# Altium project PCB_Project.PrjPcb
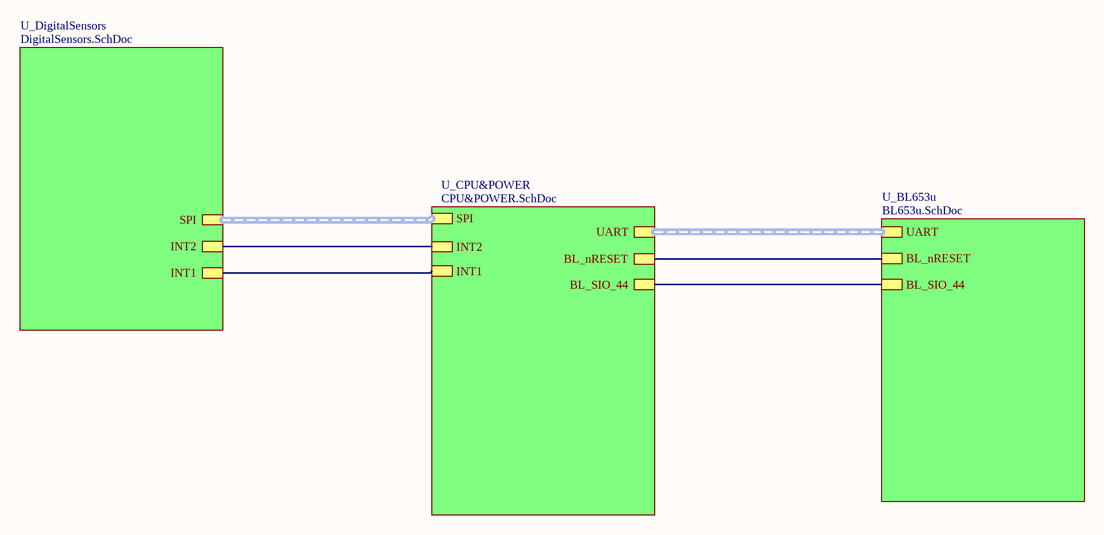
[diagram p0: Main.SchDoc]
2 sheets, 18 parts. Net scope: hierarchical (ports join the sheet entries above them; power ports are global).
Board file: PCB_Heartband.PcbDoc
Sheets:
  Main.SchDoc
    U_CPU&POWER = CPU&POWER.SchDoc

## Sheet Main.SchDoc: Sweet Dreams - Main
size 292 x 193 mm; Author: Mikołaj Roszczyk; CompanyName: Politechnika Warszawska; Organization: WEITI; Revision: 2; SheetNumber: 1; SheetTotal: 4; Group_Name: Under Pressure; ProjName: Sweet Dreams

### Sub-sheets
U_BL653u = BL653u.SchDoc (file not in this document): UART (harness BL_UART31), BL_nRESET, BL_SIO_44
U_CPU&POWER = CPU&POWER.SchDoc: SPI (harness SPI1), INT2, INT1, UART (harness BL_UART31), BL_SIO_44, BL_nRESET
U_DigitalSensors = DigitalSensors.SchDoc (file not in this document): SPI (harness SPI1), INT1, INT2

### Nets
NetIC1_18: sheet U_DigitalSensors/INT1, sheet U_CPU&POWER/INT1
NetIC1_25: sheet U_BL653u/BL_nRESET, sheet U_CPU&POWER/BL_nRESET
NetIC1_26: sheet U_BL653u/BL_SIO_44, sheet U_CPU&POWER/BL_SIO_44
NetIC1_27: sheet U_DigitalSensors/INT2, sheet U_CPU&POWER/INT2

### Buses and harness runs
harness sheet U_BL653u/UART = sheet U_CPU&POWER/UART
harness sheet U_CPU&POWER/SPI = sheet U_DigitalSensors/SPI

### Notes on the sheet
- Data:
- Tytuł:
- Rev.:
- Rozm.:
- A4
- Strona:
- z
- PBL4
- Opracował:

## Sheet CPU&POWER.SchDoc: MCU&Power
size 292 x 193 mm; Author: Michał Borkowski; CompanyName: Politechnika Warszawska; Organization: WEITI; Revision: 3; SheetNumber: 4; SheetTotal: 4; ProjName: Sweet Dreams; Group_Name: Under Pressure
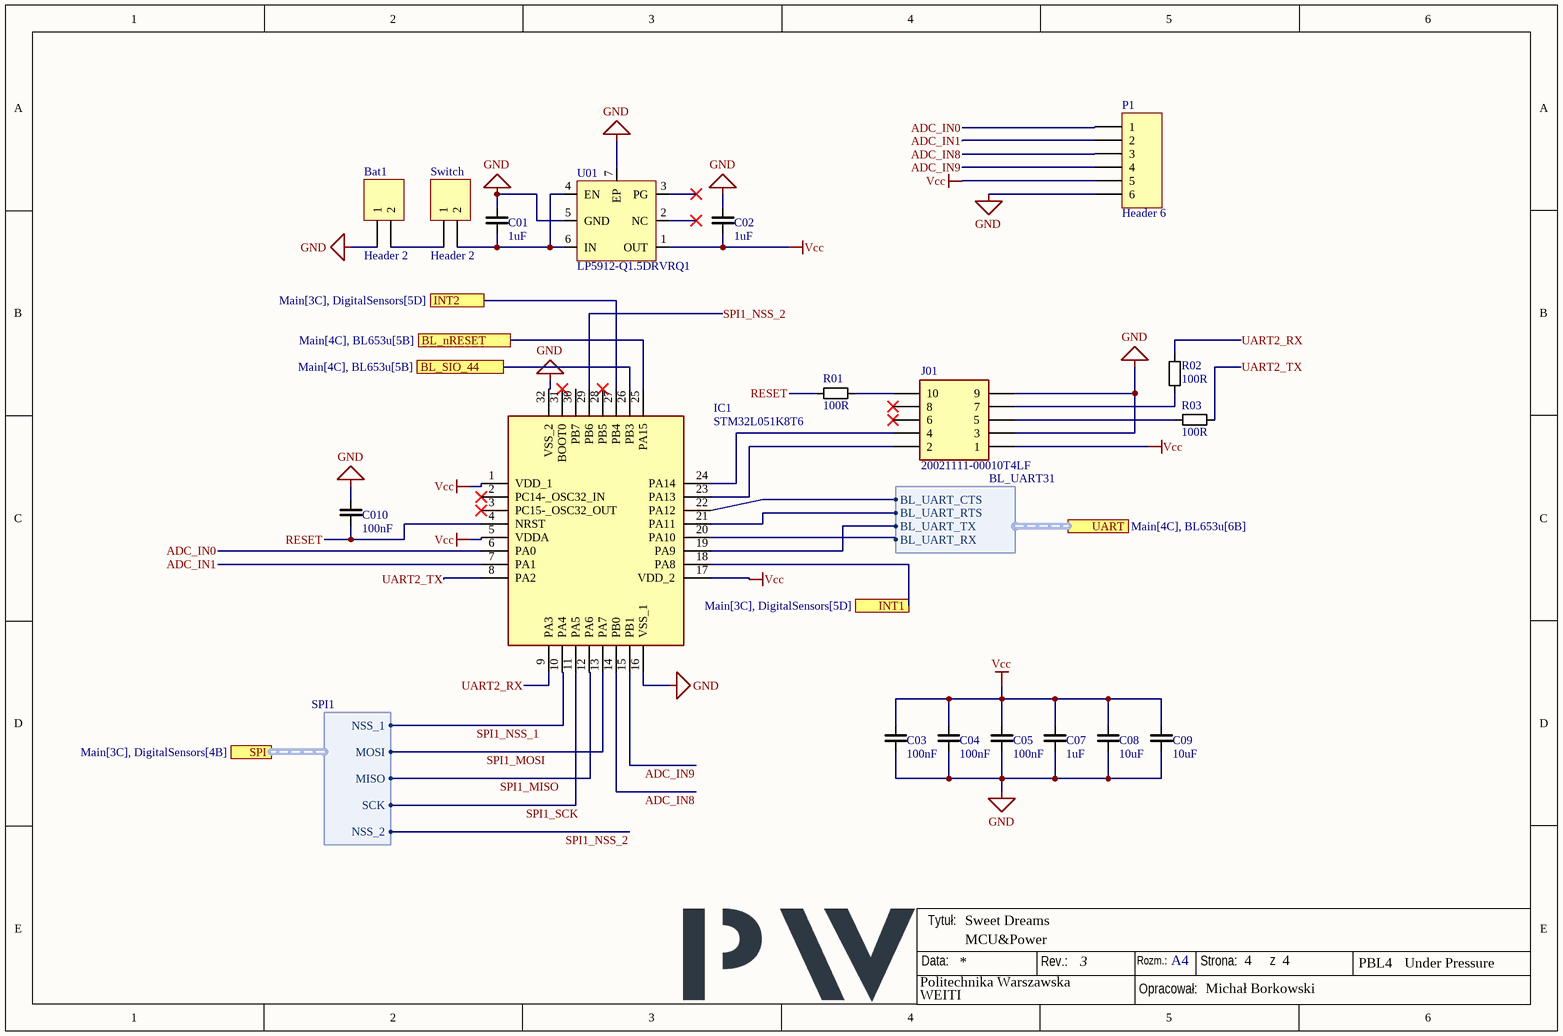
[diagram p1: CPU&POWER.SchDoc]

### Parts
Bat1  Header 2  [HDR1X2]
C01  1uF  [0402_CAP]
C02  1uF  [0402_CAP]
C03  100nF  [0402_CAP]
C04  100nF  [0402_CAP]
C05  100nF  [0402_CAP]
C07  1uF  [0402_CAP]
C08  10uF  [0402_CAP]
C09  10uF  [0402_CAP]
C010  100nF  [0402_CAP]
IC1  STM32L051K8T6  [QFP80P900X900X160-32N]
J01  20021111-00010T4LF  [HDRV10W41P127_2X5_635X343X575P_m]
P1  Header 6  [HDR1X6]
R01  100R  [0402_RES]
R02  100R  [0402_RES]
R03  100R  [0402_RES]
Switch  Header 2  [HDR1X2]
U01  LP5912-Q1.5DRVRQ1  [SON65P200X200X80-7N_m]

### Ports
BL_nRESET (see Main[4C], BL653u[5B]), BL_SIO_44 (see Main[4C], BL653u[5B]), INT1 (see Main[3C], DigitalSensors[5D]), INT2 (see Main[3C], DigitalSensors[5D]), SPI (harness SPI1, see Main[3C], DigitalSensors[4B]), UART (harness BL_UART31, see Main[4C], BL653u[6B])

### Harnesses
SPI1: NSS_1, MOSI, MISO, SCK, NSS_2
BL_UART31: BL_UART_RTS, BL_UART_CTS, BL_UART_RX, BL_UART_TX

### Nets
GND: Bat1.1 C01.2 C02.2 C03.1 C04.1 C05.1 C07.1 C08.1 C09.1 C010.2 IC1.16(VSS_1) IC1.32(VSS_2) J01.3 J01.9 P1.6 U01.5(GND) U01.7(EP)
Vcc: C02.1 C03.2 C04.2 C05.2 C07.2 C08.2 C09.2 IC1.1(VDD_1) IC1.5(VDDA) IC1.17(VDD_2) J01.1 P1.5 U01.1(OUT)
ADC_IN0: IC1.6(PA0) P1.1
ADC_IN1: IC1.7(PA1) P1.2
ADC_IN8: IC1.14(PB0) P1.3
ADC_IN9: IC1.15(PB1) P1.4
RESET: C010.1 IC1.4(NRST) R01.1
SPI1_MISO: IC1.12(PA6) ; port SPI.MISO
SPI1_MOSI: IC1.13(PA7) ; port SPI.MOSI
SPI1_NSS_1: IC1.10(PA4) ; port SPI.NSS_1
SPI1_NSS_2: IC1.29(PB6) ; port SPI.NSS_2
UART2_RX: IC1.9(PA3) R02.2
UART2_TX: IC1.8(PA2) R03.1
NetBat1_2: Bat1.2 Switch.1
NetC01_1: C01.1 Switch.2 U01.4(EN) U01.6(IN)
NetIC1_11: IC1.11(PA5) ; port SPI.SCK
NetIC1_18: IC1.18(PA8) ; port INT1
NetIC1_19: IC1.19(PA9) ; port UART.BL_UART_TX
NetIC1_20: IC1.20(PA10) ; port UART.BL_UART_RX
NetIC1_21: IC1.21(PA11) ; port UART.BL_UART_RTS
NetIC1_22: IC1.22(PA12) ; port UART.BL_UART_CTS
NetIC1_23: IC1.23(PA13) J01.2
NetIC1_24: IC1.24(PA14) J01.4
NetIC1_25: IC1.25(PA15) ; port BL_nRESET
NetIC1_26: IC1.26(PB3) ; port BL_SIO_44
NetIC1_27: IC1.27(PB4) ; port INT2
NetJ01_5: J01.5 R03.2
NetJ01_7: J01.7 R02.1
NetJ01_10: J01.10 R01.2

Not connected (* = marked no-connect by the designer): IC1 2(PC14-_OSC32_IN)* 3(PC15-_OSC32_OUT)* 28(PB5)* 30(PB7) 31(BOOT0)*; J01 6* 8*; U01 2(NC)* 3(PG)*

### Notes on the sheet
- Labels drawn without touching a wire or pin: SPI1_SCK
- Data:
- Tytuł:
- Rev.:
- Rozm.:
- A4
- Strona:
- z
- PBL4
- Opracował:

### Library data of the parts
Bat1 Switch = Header 2: Header, 2-Pin; LatestRevisionDate: 17-Jul-2002; LatestRevisionNote: Re-released for DXP Platform.; Publisher: Altium Limited
C01 C02 C03 C04 C05 C07 C08 C09 C010 = Cap: Ceramic capacitor
IC1 = STM32L051K8T6: Integrated Circuit; Manufacturer_Name: STMicroelectronics; Datasheet Link: https://www.mouser.in/datasheet/2/389/dm00108219-1798237.pdf; Height: 1.6mm; Manufacturer_Part_Number: STM32L051K8T6; Mouser Part Number: 511-STM32L051K8T6; Mouser Price/Stock: https://www.mouser.co.uk/ProductDetail/STMicroelectronics/STM32L051K8T6?qs=s5SkPsIz108Y%252BphFHRhdjA%3D%3D; Arrow Part Number: STM32L051K8T6; Arrow Price/Stock: https://www.arrow.com/en/products/stm32l051k8t6/stmicroelectronics?region=nac
J01 = 20021111-00010T4LF: Connector; Manufacturer_Name: Amphenol Communications Solutions; Datasheet Link: https://cdn.amphenol-cs.com/media/wysiwyg/files/drawing/20021111.pdf; Height: 5.75mm; Manufacturer_Part_Number: 20021111-00010T4LF; Mouser Part Number: 649-221111-00010T4LF; Mouser Price/Stock: https://www.mouser.co.uk/ProductDetail/Amphenol-FCI/20021111-00010T4LF?qs=nwYJ12Fl9gR8B5xkaYs9gA%3D%3D; Arrow Part Number: 20021111-00010T4LF; Arrow Price/Stock: https://www.arrow.com/en/products/20021111-00010t4lf/amphenol-fci?region=europe
P1 = Header 6: Header, 6-Pin; LatestRevisionDate: 17-Jul-2002; LatestRevisionNote: Re-released for DXP Platform.; Publisher: Altium Limited
R01 R02 R03 = RES: Resistor
U01 = STAB